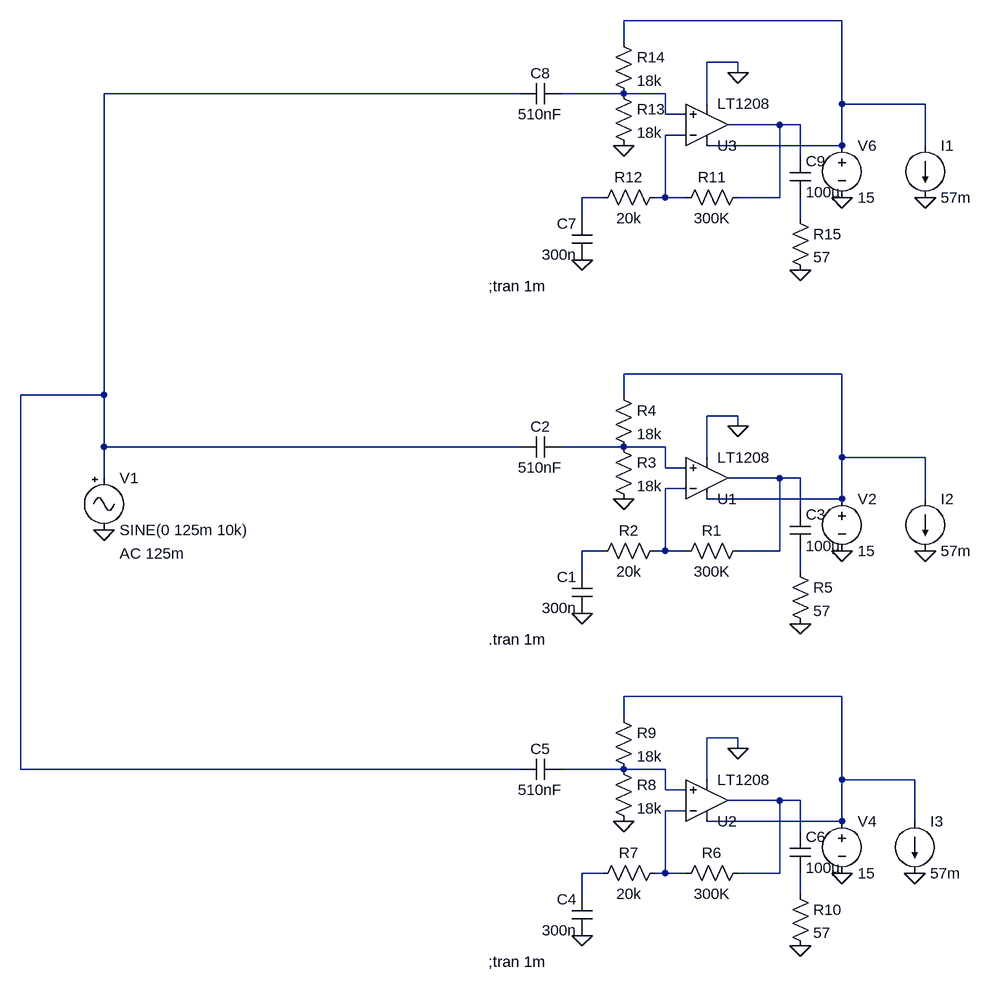
[diagram p0: schematic całyukład.asc]
całyukład.asc, the LTspice schematic file:
Version 4
SHEET 1 880 792
WIRE 176 -672 -160 -672
WIRE -160 -640 -160 -672
WIRE 16 -608 -32 -608
WIRE 16 -592 16 -608
WIRE -320 -560 -960 -560
WIRE -160 -560 -256 -560
WIRE -96 -560 -160 -560
WIRE -32 -544 -32 -608
WIRE 176 -544 176 -672
WIRE 304 -544 176 -544
WIRE -96 -528 -96 -560
WIRE -64 -528 -96 -528
WIRE 80 -512 0 -512
WIRE 112 -512 80 -512
WIRE -64 -496 -96 -496
WIRE 176 -480 176 -544
WIRE 176 -480 -32 -480
WIRE 304 -480 304 -544
WIRE 112 -464 112 -512
WIRE -192 -400 -224 -400
WIRE -96 -400 -96 -496
WIRE -96 -400 -112 -400
WIRE -64 -400 -96 -400
WIRE 80 -400 80 -512
WIRE 80 -400 16 -400
WIRE -224 -368 -224 -400
WIRE 112 -368 112 -400
WIRE 176 -128 -160 -128
WIRE -960 -96 -960 -560
WIRE -960 -96 -1088 -96
WIRE -160 -96 -160 -128
WIRE 16 -64 -32 -64
WIRE 16 -48 16 -64
WIRE -960 -16 -960 -96
WIRE -320 -16 -960 -16
WIRE -160 -16 -256 -16
WIRE -96 -16 -160 -16
WIRE -32 0 -32 -64
WIRE 176 0 176 -128
WIRE 304 0 176 0
WIRE -96 16 -96 -16
WIRE -64 16 -96 16
WIRE -960 32 -960 -16
WIRE 80 32 0 32
WIRE 112 32 80 32
WIRE -64 48 -96 48
WIRE 176 64 176 0
WIRE 176 64 -32 64
WIRE 304 64 304 0
WIRE 112 80 112 32
WIRE -192 144 -224 144
WIRE -96 144 -96 48
WIRE -96 144 -112 144
WIRE -64 144 -96 144
WIRE 80 144 80 32
WIRE 80 144 16 144
WIRE -224 176 -224 144
WIRE 112 176 112 144
WIRE 176 368 -160 368
WIRE -160 400 -160 368
WIRE 16 432 -32 432
WIRE 16 448 16 432
WIRE -1088 480 -1088 -96
WIRE -320 480 -1088 480
WIRE -160 480 -256 480
WIRE -96 480 -160 480
WIRE -32 496 -32 432
WIRE 176 496 176 368
WIRE 288 496 176 496
WIRE -96 512 -96 480
WIRE -64 512 -96 512
WIRE 80 528 0 528
WIRE 112 528 80 528
WIRE -64 544 -96 544
WIRE 176 560 176 496
WIRE 176 560 -32 560
WIRE 288 560 288 496
WIRE 112 576 112 528
WIRE -192 640 -224 640
WIRE -96 640 -96 544
WIRE -96 640 -112 640
WIRE -64 640 -96 640
WIRE 80 640 80 528
WIRE 80 640 16 640
WIRE -224 672 -224 640
WIRE 112 672 112 640
FLAG -224 240 0
FLAG -160 64 0
FLAG 16 -48 0
FLAG -960 112 0
FLAG 176 144 0
FLAG 112 256 0
FLAG -224 736 0
FLAG -160 560 0
FLAG 16 448 0
FLAG 176 640 0
FLAG 112 752 0
FLAG -224 -304 0
FLAG -160 -480 0
FLAG 16 -592 0
FLAG 176 -400 0
FLAG 112 -288 0
FLAG 304 -400 0
FLAG 304 144 0
FLAG 288 640 0
SYMBOL res 32 128 R90
WINDOW 0 0 56 VBottom 2
WINDOW 3 32 56 VTop 2
SYMATTR InstName R1
SYMATTR Value 300K
SYMBOL res -96 128 R90
WINDOW 0 0 56 VBottom 2
WINDOW 3 32 56 VTop 2
SYMATTR InstName R2
SYMATTR Value 20k
SYMBOL cap -208 240 R180
WINDOW 0 24 56 Left 2
WINDOW 3 24 8 Left 2
SYMATTR InstName C1
SYMATTR Value 300n
SYMBOL res -176 -32 R0
SYMATTR InstName R3
SYMATTR Value 18k
SYMBOL res -176 -112 R0
SYMATTR InstName R4
SYMATTR Value 18k
SYMBOL cap -256 -32 R90
WINDOW 0 0 32 VBottom 2
WINDOW 3 32 32 VTop 2
SYMATTR InstName C2
SYMATTR Value 510nF
SYMBOL Misc\\signal -960 16 R0
WINDOW 123 24 132 Left 2
WINDOW 39 0 0 Left 0
SYMATTR Value2 AC 125m
SYMATTR InstName V1
SYMATTR Value SINE(0 125m 10k)
SYMBOL voltage 176 48 R0
WINDOW 123 0 0 Left 0
WINDOW 39 0 0 Left 0
SYMATTR InstName V2
SYMATTR Value 15
SYMBOL cap 96 80 R0
SYMATTR InstName C3
SYMATTR Value 100µ
SYMBOL res 96 160 R0
SYMATTR InstName R5
SYMATTR Value 57
SYMBOL OpAmps\\LT1208 -32 96 M180
SYMATTR InstName U1
SYMBOL res 32 624 R90
WINDOW 0 0 56 VBottom 2
WINDOW 3 32 56 VTop 2
SYMATTR InstName R6
SYMATTR Value 300K
SYMBOL res -96 624 R90
WINDOW 0 0 56 VBottom 2
WINDOW 3 32 56 VTop 2
SYMATTR InstName R7
SYMATTR Value 20k
SYMBOL cap -208 736 R180
WINDOW 0 24 56 Left 2
WINDOW 3 24 8 Left 2
SYMATTR InstName C4
SYMATTR Value 300n
SYMBOL res -176 464 R0
SYMATTR InstName R8
SYMATTR Value 18k
SYMBOL res -176 384 R0
SYMATTR InstName R9
SYMATTR Value 18k
SYMBOL cap -256 464 R90
WINDOW 0 0 32 VBottom 2
WINDOW 3 32 32 VTop 2
SYMATTR InstName C5
SYMATTR Value 510nF
SYMBOL voltage 176 544 R0
WINDOW 123 0 0 Left 0
WINDOW 39 0 0 Left 0
SYMATTR InstName V4
SYMATTR Value 15
SYMBOL cap 96 576 R0
SYMATTR InstName C6
SYMATTR Value 100µ
SYMBOL res 96 656 R0
SYMATTR InstName R10
SYMATTR Value 57
SYMBOL OpAmps\\LT1208 -32 592 M180
SYMATTR InstName U2
SYMBOL res 32 -416 R90
WINDOW 0 0 56 VBottom 2
WINDOW 3 32 56 VTop 2
SYMATTR InstName R11
SYMATTR Value 300K
SYMBOL res -96 -416 R90
WINDOW 0 0 56 VBottom 2
WINDOW 3 32 56 VTop 2
SYMATTR InstName R12
SYMATTR Value 20k
SYMBOL cap -208 -304 R180
WINDOW 0 24 56 Left 2
WINDOW 3 24 8 Left 2
SYMATTR InstName C7
SYMATTR Value 300n
SYMBOL res -176 -576 R0
SYMATTR InstName R13
SYMATTR Value 18k
SYMBOL res -176 -656 R0
SYMATTR InstName R14
SYMATTR Value 18k
SYMBOL cap -256 -576 R90
WINDOW 0 0 32 VBottom 2
WINDOW 3 32 32 VTop 2
SYMATTR InstName C8
SYMATTR Value 510nF
SYMBOL voltage 176 -496 R0
WINDOW 123 0 0 Left 0
WINDOW 39 0 0 Left 0
SYMATTR InstName V6
SYMATTR Value 15
SYMBOL cap 96 -464 R0
SYMATTR InstName C9
SYMATTR Value 100µ
SYMBOL res 96 -384 R0
SYMATTR InstName R15
SYMATTR Value 57
SYMBOL OpAmps\\LT1208 -32 -448 M180
SYMATTR InstName U3
SYMBOL current 304 -480 R0
WINDOW 123 0 0 Left 0
WINDOW 39 0 0 Left 0
SYMATTR InstName I1
SYMATTR Value 57m
SYMBOL current 304 64 R0
WINDOW 123 0 0 Left 0
WINDOW 39 0 0 Left 0
SYMATTR InstName I2
SYMATTR Value 57m
SYMBOL current 288 560 R0
WINDOW 123 0 0 Left 0
WINDOW 39 0 0 Left 0
SYMATTR InstName I3
SYMATTR Value 57m
TEXT -368 280 Left 2 !.tran 1m
TEXT -368 776 Left 2 !;tran 1m
TEXT -368 -264 Left 2 !;tran 1m

The netlist it stands for:
* całyukład.asc
R1 N010 N011 300K
R2 N011 N012 20k
C1 0 N012 300n
R3 N009 0 18k
R4 N008 N009 18k
C2 N009 N002 510nF
V1 N002 0 SINE(0 125m 10k) AC 125m
V2 N008 0 15
C3 N010 N013 100µ
R5 N013 0 57
XU1 N009 N011 N008 0 N010 LT1208  ; pins In+ In- V+ V- OUT
R6 N016 N017 300K
R7 N017 N018 20k
C4 0 N018 300n
R8 N015 0 18k
R9 N014 N015 18k
C5 N015 N002 510nF
V4 N014 0 15
C6 N016 N019 100µ
R10 N019 0 57
XU2 N015 N017 N014 0 N016 LT1208  ; pins In+ In- V+ V- OUT
R11 N004 N005 300K
R12 N005 N006 20k
C7 0 N006 300n
R13 N003 0 18k
R14 N001 N003 18k
C8 N003 N002 510nF
V6 N001 0 15
C9 N004 N007 100µ
R15 N007 0 57
XU3 N003 N005 N001 0 N004 LT1208  ; pins In+ In- V+ V- OUT
I1 N001 0 57m
I2 N008 0 57m
I3 N014 0 57m
.tran 1m
;tran 1m
;tran 1m
.backanno
.end